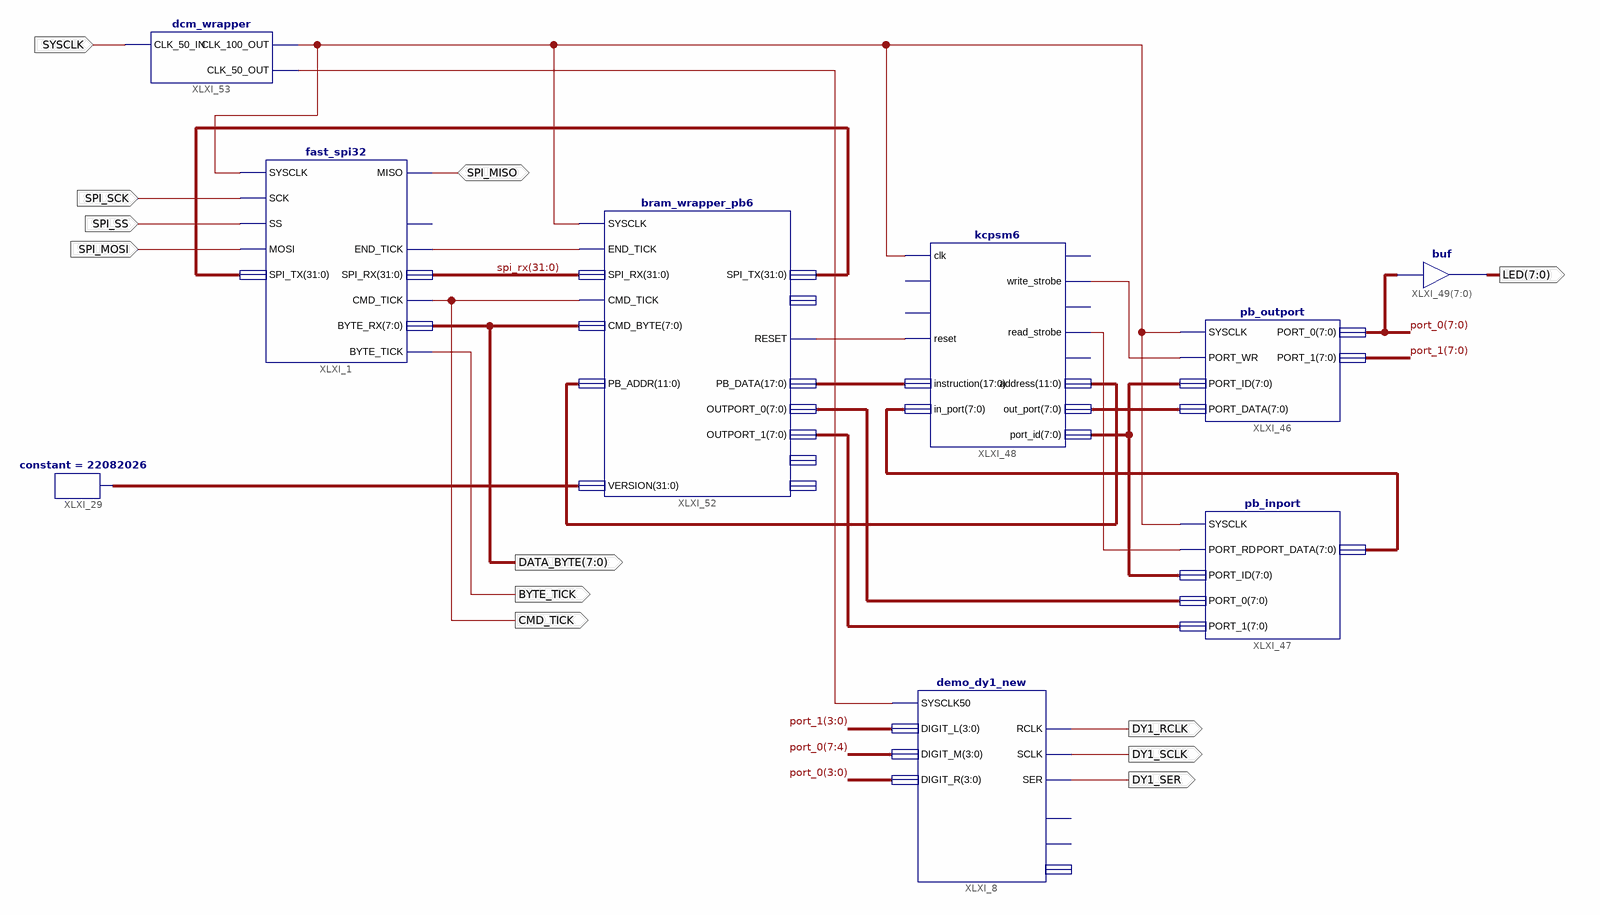
[diagram p0: schematic sheet 1]
// Xilinx ISE schematic mojo_pb_test.sch (spartan6) as structural Verilog: 9 symbols, 12 ports
module mojo_pb_test (
  input  SPI_MOSI,
  input  SPI_SS,
  input  SPI_SCK,
  input  SYSCLK,
  inout  SPI_MISO,
  output DY1_RCLK,
  output DY1_SCLK,
  output DY1_SER,
  output [7:0] LED,
  output [7:0] DATA_BYTE,
  output CMD_TICK,
  output BYTE_TICK
);

  wire SYSCLK50, SYSCLK100, XLXN_170, XLXN_176, XLXN_189, XLXN_234;
  wire [7:0] port_0, port_1, XLXN_169, XLXN_174, XLXN_185, XLXN_186, XLXN_187;
  wire [11:0] XLXN_167;
  wire [17:0] XLXN_166;
  wire [31:0] spi_rx, XLXN_102, XLXN_196;

  demo_dy1_new XLXI_8 (
    .SYSCLK50(SYSCLK50), .RCLK(DY1_RCLK), .SCLK(DY1_SCLK), .SER(DY1_SER), .DIGIT_L(port_1[3:0]),
    .DIGIT_M(port_0[7:4]), .DIGIT_R(port_0[3:0]));  // open: LED_BLINK, TICK_12HZ, BLINK_COUNT
  fast_spi32 XLXI_1 (
    .SYSCLK(SYSCLK100), .SCK(SPI_SCK), .SS(SPI_SS), .MOSI(SPI_MOSI), .SPI_TX(XLXN_102), .MISO(SPI_MISO),
    .CMD_TICK(CMD_TICK), .BYTE_TICK(BYTE_TICK), .END_TICK(XLXN_234), .SPI_RX(spi_rx), .BYTE_RX(DATA_BYTE));  // open: START_TICK
  pb_inport XLXI_47 (
    .SYSCLK(SYSCLK100), .PORT_RD(XLXN_176), .PORT_ID(XLXN_169), .PORT_0(XLXN_185), .PORT_1(XLXN_186),
    .PORT_DATA(XLXN_174));
  kcpsm6 XLXI_48 (
    .instruction(XLXN_166), .write_strobe(XLXN_170), .read_strobe(XLXN_176), .address(XLXN_167),
    .out_port(XLXN_187), .port_id(XLXN_169), .clk(SYSCLK100), .reset(XLXN_189), .in_port(XLXN_174));  // open: bram_enable, k_write_strobe, interrupt_ack, interrupt, sleep
  assign LED = port_0;  // buf XLXI_49[7..0], 8 bits wide
  pb_outport XLXI_46 (
    .SYSCLK(SYSCLK100), .PORT_WR(XLXN_170), .PORT_ID(XLXN_169), .PORT_DATA(XLXN_187), .PORT_0(port_0),
    .PORT_1(port_1));
  bram_wrapper_pb6 XLXI_52 (
    .SYSCLK(SYSCLK100), .CMD_TICK(CMD_TICK), .END_TICK(XLXN_234), .SPI_RX(spi_rx), .VERSION(XLXN_196),
    .PB_ADDR(XLXN_167), .PB_DATA(XLXN_166), .RESET(XLXN_189), .SPI_TX(XLXN_102), .OUTPORT_0(XLXN_185),
    .OUTPORT_1(XLXN_186), .CMD_BYTE(DATA_BYTE));  // open: CFG_PORT, OUTPORT_2, OUTPORT_3
  constant #(.CValue("22082026")) XLXI_29 (.O(XLXN_196));
  dcm_wrapper XLXI_53 (.CLK_50_IN(SYSCLK), .CLK_100_OUT(SYSCLK100), .CLK_50_OUT(SYSCLK50));
endmodule
